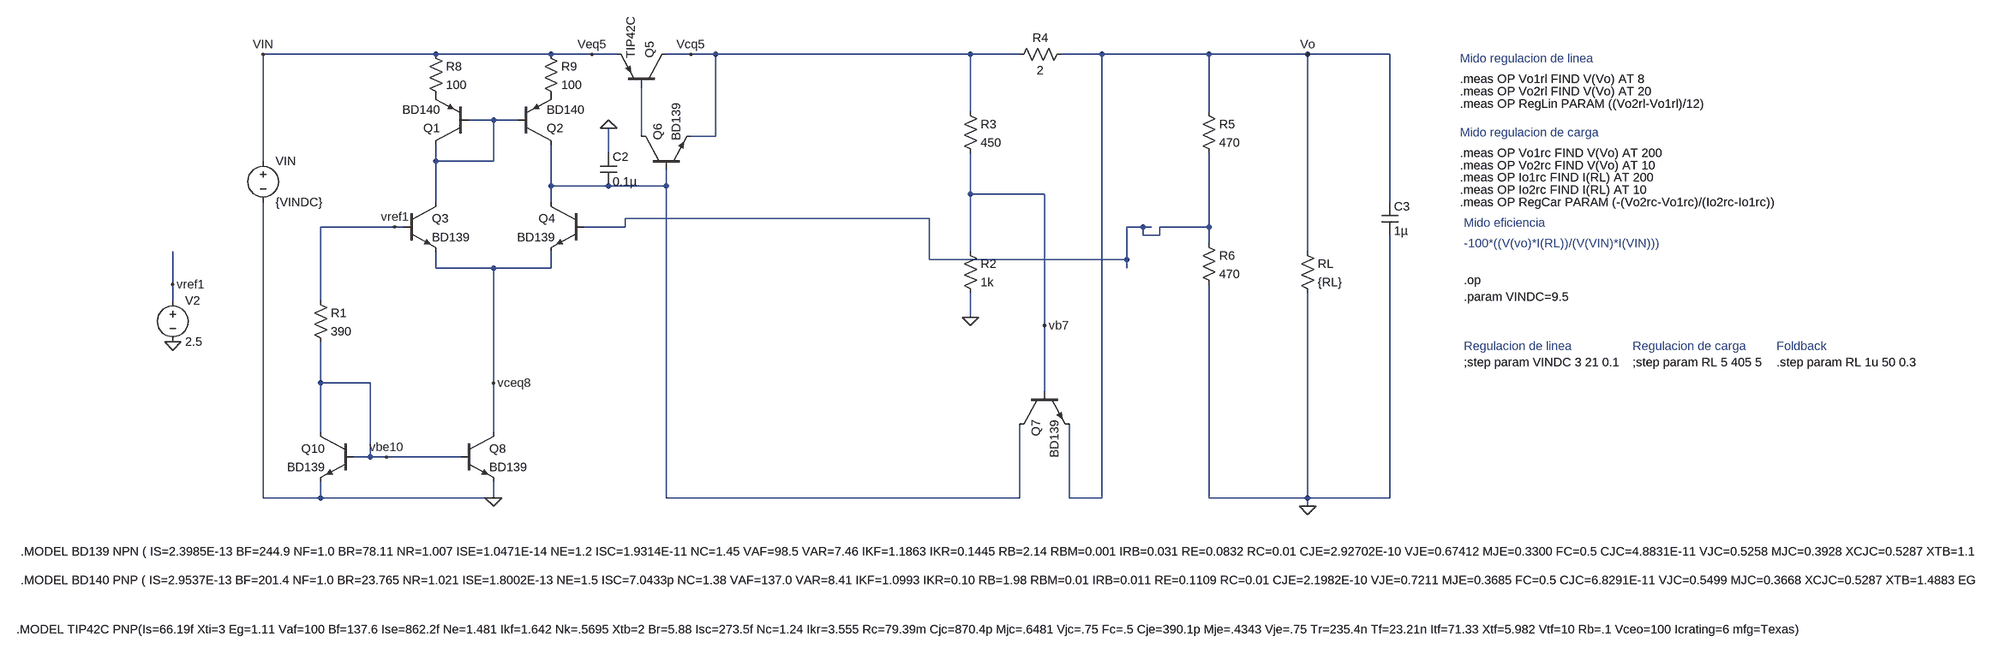
[diagram p0: schematic regulador_lineal_compensado.asc]
regulador_lineal_compensado.asc, the LTspice schematic file:
Version 4.1
SHEET 1 4052 1104
WIRE 96 -32 -240 -32
WIRE 320 -32 96 -32
WIRE 400 -32 320 -32
WIRE 448 -32 400 -32
WIRE 592 -32 544 -32
WIRE 640 -32 592 -32
WIRE 1136 -32 640 -32
WIRE 1232 -32 1136 -32
WIRE 1392 -32 1312 -32
WIRE 1600 -32 1392 -32
WIRE 1792 -32 1600 -32
WIRE 1952 -32 1792 -32
WIRE 1136 80 1136 -32
WIRE 1600 80 1600 -32
WIRE 208 96 160 96
WIRE 256 96 208 96
WIRE 496 128 496 32
WIRE 640 128 640 -32
WIRE 640 128 592 128
WIRE 432 160 432 112
WIRE -240 176 -240 -32
WIRE 96 176 96 144
WIRE 208 176 208 96
WIRE 208 176 96 176
WIRE 320 224 320 144
WIRE 432 224 320 224
WIRE 544 224 544 192
WIRE 544 224 432 224
WIRE 1136 240 1136 160
WIRE 1280 240 1136 240
WIRE 96 256 96 176
WIRE 320 256 320 224
WIRE 1952 256 1952 -32
WIRE 1056 288 464 288
WIRE 16 304 -128 304
WIRE 32 304 16 304
WIRE 464 304 464 288
WIRE 464 304 384 304
WIRE 1472 304 1440 304
WIRE 1488 304 1472 304
WIRE 1600 304 1600 160
WIRE 1600 304 1504 304
WIRE 1472 320 1472 304
WIRE 1504 320 1504 304
WIRE 1504 320 1472 320
WIRE 1600 336 1600 304
WIRE 1136 352 1136 240
WIRE 1792 352 1792 -32
WIRE 1056 368 1056 288
WIRE 1440 368 1440 304
WIRE 1440 368 1056 368
WIRE 96 384 96 352
WIRE 208 384 96 384
WIRE 320 384 320 352
WIRE 320 384 208 384
WIRE 1440 384 1440 368
WIRE -416 416 -416 352
WIRE -416 448 -416 416
WIRE -128 448 -128 304
WIRE 1136 480 1136 432
WIRE 1280 496 1280 240
WIRE -128 608 -128 528
WIRE -32 608 -128 608
WIRE 208 608 208 384
WIRE 1280 624 1280 496
WIRE -128 704 -128 608
WIRE 208 704 208 608
WIRE -32 752 -32 608
WIRE -32 752 -64 752
WIRE 0 752 -32 752
WIRE 144 752 0 752
WIRE -240 832 -240 256
WIRE -128 832 -128 800
WIRE -128 832 -240 832
WIRE 208 832 208 800
WIRE 208 832 -128 832
WIRE 544 832 544 224
WIRE 1232 832 1232 688
WIRE 1232 832 544 832
WIRE 1328 832 1328 688
WIRE 1392 832 1392 -32
WIRE 1392 832 1328 832
WIRE 1600 832 1600 416
WIRE 1792 832 1792 432
WIRE 1792 832 1600 832
WIRE 1952 832 1952 320
WIRE 1952 832 1792 832
WIRE 1792 848 1792 832
FLAG 1792 -32 Vo
FLAG -240 -32 VIN
FLAG 1792 848 0
FLAG 208 832 0
FLAG 1136 480 0
FLAG 0 752 vbe10
FLAG -416 416 vref1
FLAG -416 528 0
FLAG 16 304 vref1
FLAG 208 608 vceq8
FLAG 400 -32 Veq5
FLAG 592 -32 Vcq5
FLAG 1280 496 vb7
FLAG 432 112 0
SYMBOL pnp 160 144 R180
SYMATTR InstName Q1
SYMATTR Value BD140
SYMBOL pnp 256 144 M180
SYMATTR InstName Q2
SYMATTR Value BD140
SYMBOL npn 32 256 R0
SYMATTR InstName Q3
SYMATTR Value BD139
SYMBOL npn 384 256 M0
SYMATTR InstName Q4
SYMATTR Value BD139
SYMBOL pnp 544 32 M270
SYMATTR InstName Q5
SYMATTR Value TIP42C
SYMBOL npn 496 192 R270
SYMATTR InstName Q6
SYMATTR Value BD139
SYMBOL voltage -240 160 R0
WINDOW 123 24 124 Left 2
WINDOW 39 0 0 Left 0
SYMATTR InstName VIN
SYMATTR Value {VINDC}
SYMBOL res 80 -48 R0
SYMATTR InstName R8
SYMATTR Value 100
SYMBOL res 304 -48 R0
SYMATTR InstName R9
SYMATTR Value 100
SYMBOL cap 1936 256 R0
SYMATTR InstName C3
SYMATTR Value 1µ
SYMBOL res 1120 64 R0
SYMATTR InstName R3
SYMATTR Value 450
SYMBOL res 1120 336 R0
SYMATTR InstName R2
SYMATTR Value 1k
SYMBOL res 1328 -48 R90
WINDOW 0 0 56 VBottom 2
WINDOW 3 32 56 VTop 2
SYMATTR InstName R4
SYMATTR Value 2
SYMBOL npn 1232 624 M90
SYMATTR InstName Q7
SYMATTR Value BD139
SYMBOL res 1584 64 R0
SYMATTR InstName R5
SYMATTR Value 470
SYMBOL res 1584 320 R0
SYMATTR InstName R6
SYMATTR Value 470
SYMBOL npn 144 704 R0
SYMATTR InstName Q8
SYMATTR Value BD139
SYMBOL npn -64 704 M0
SYMATTR InstName Q10
SYMATTR Value BD139
SYMBOL res 1776 336 R0
SYMATTR InstName RL
SYMATTR Value {RL}
SYMBOL res -144 432 R0
SYMATTR InstName R1
SYMATTR Value 390
SYMBOL voltage -416 432 R0
WINDOW 123 24 124 Left 2
WINDOW 39 0 0 Left 0
SYMATTR InstName V2
SYMATTR Value 2.5
SYMBOL cap 416 160 R0
SYMATTR InstName C2
SYMATTR Value 0.1µ
TEXT 2088 -24 Left 2 ;Mido regulacion de linea
TEXT 2088 16 Left 2 !.meas OP Vo1rl FIND V(Vo) AT 8
TEXT 2088 40 Left 2 !.meas OP Vo2rl FIND V(Vo) AT 20
TEXT 2088 64 Left 2 !.meas OP RegLin PARAM ((Vo2rl-Vo1rl)/12)
TEXT 2088 120 Left 2 ;Mido regulacion de carga
TEXT 2088 160 Left 2 !.meas OP Vo1rc FIND V(Vo) AT 200
TEXT 2088 184 Left 2 !.meas OP Vo2rc FIND V(Vo) AT 10
TEXT 2088 208 Left 2 !.meas OP Io1rc FIND I(RL) AT 200
TEXT 2088 232 Left 2 !.meas OP Io2rc FIND I(RL) AT 10
TEXT 2096 296 Left 2 ;Mido eficiencia
TEXT 2096 336 Left 2 ;-100*((V(vo)*I(RL))/(V(VIN)*I(VIN)))
TEXT 2096 440 Left 2 !.param VINDC=9.5
TEXT 2088 256 Left 2 !.meas OP RegCar PARAM (-(Vo2rc-Vo1rc)/(Io2rc-Io1rc))
TEXT 2096 568 Left 2 !;step param VINDC 3 21 0.1
TEXT -712 936 Left 2 !.MODEL BD139 NPN ( IS=2.3985E-13 BF=244.9 NF=1.0 BR=78.11 NR=1.007 ISE=1.0471E-14 NE=1.2 ISC=1.9314E-11 NC=1.45 VAF=98.5 VAR=7.46 IKF=1.1863 IKR=0.1445 RB=2.14 RBM=0.001 IRB=0.031 RE=0.0832 RC=0.01 CJE=2.92702E-10 VJE=0.67412 MJE=0.3300 FC=0.5 CJC=4.8831E-11 VJC=0.5258 MJC=0.3928 XCJC=0.5287 XTB=1.1398 EG=1.2105 XTI=3.0 Vceo=80 Icrating=3 mfg=fairchild)
TEXT -712 992 Left 2 !.MODEL BD140 PNP ( IS=2.9537E-13 BF=201.4 NF=1.0 BR=23.765 NR=1.021 ISE=1.8002E-13 NE=1.5 ISC=7.0433p NC=1.38 VAF=137.0 VAR=8.41 IKF=1.0993 IKR=0.10 RB=1.98 RBM=0.01 IRB=0.011 RE=0.1109 RC=0.01 CJE=2.1982E-10 VJE=0.7211 MJE=0.3685 FC=0.5 CJC=6.8291E-11 VJC=0.5499 MJC=0.3668 XCJC=0.5287 XTB=1.4883 EG=1.2343 XTI=3.0 Vceo=80 Icrating=3 mfg=fairchild)
TEXT 2704 568 Left 2 !.step param RL 1u 50 0.3
TEXT 2704 536 Left 2 ;Foldback
TEXT 2096 536 Left 2 ;Regulacion de linea
TEXT 2424 568 Left 2 !;step param RL 5 405 5
TEXT 2424 536 Left 2 ;Regulacion de carga
TEXT -720 1088 Left 2 !.MODEL TIP42C PNP(Is=66.19f Xti=3 Eg=1.11 Vaf=100 Bf=137.6 Ise=862.2f Ne=1.481 Ikf=1.642 Nk=.5695 Xtb=2 Br=5.88 Isc=273.5f Nc=1.24 Ikr=3.555 Rc=79.39m Cjc=870.4p Mjc=.6481 Vjc=.75 Fc=.5 Cje=390.1p Mje=.4343 Vje=.75 Tr=235.4n Tf=23.21n Itf=71.33 Xtf=5.982 Vtf=10 Rb=.1 Vceo=100 Icrating=6 mfg=Texas)
TEXT 2096 408 Left 2 !.op

The netlist it stands for:
* regulador_lineal_compensado.asc
Q1 N001 N001 P001 0 BD140
Q2 N003 N001 P002 0 BD140
Q3 N001 vref1 vceq8 0 BD139
Q4 N003 N004 vceq8 0 BD139
Q5 Vcq5 N002 Veq5 0 TIP42C
Q6 N002 N003 Vcq5 0 BD139
VIN Veq5 0 {VINDC}
R8 Veq5 P001 100
R9 Veq5 P002 100
C3 Vo 0 1µ
R3 Vcq5 vb7 450
R2 vb7 0 1k
R4 Vo Vcq5 2
Q7 N003 vb7 Vo 0 BD139
R5 Vo N004 470
R6 N004 0 470
Q8 vceq8 vbe10 0 0 BD139
Q10 vbe10 vbe10 0 0 BD139
RL Vo 0 {RL}
R1 vref1 vbe10 390
V2 vref1 0 2.5
C2 0 N003 0.1µ
.model NPN NPN
.model PNP PNP
.lib standard.bjt
* Mido regulacion de linea
.meas OP Vo1rl FIND V(Vo) AT 8
.meas OP Vo2rl FIND V(Vo) AT 20
.meas OP RegLin PARAM ((Vo2rl-Vo1rl)/12)
* Mido regulacion de carga
.meas OP Vo1rc FIND V(Vo) AT 200
.meas OP Vo2rc FIND V(Vo) AT 10
.meas OP Io1rc FIND I(RL) AT 200
.meas OP Io2rc FIND I(RL) AT 10
* Mido eficiencia
* -100*((V(vo)*I(RL))/(V(VIN)*I(VIN)))
.param VINDC=9.5
.meas OP RegCar PARAM (-(Vo2rc-Vo1rc)/(Io2rc-Io1rc))
;step param VINDC 3 21 0.1
.MODEL BD139 NPN ( IS=2.3985E-13 BF=244.9 NF=1.0 BR=78.11 NR=1.007 ISE=1.0471E-14 NE=1.2 ISC=1.9314E-11 NC=1.45 VAF=98.5 VAR=7.46 IKF=1.1863 IKR=0.1445 RB=2.14 RBM=0.001 IRB=0.031 RE=0.0832 RC=0.01 CJE=2.92702E-10 VJE=0.67412 MJE=0.3300 FC=0.5 CJC=4.8831E-11 VJC=0.5258 MJC=0.3928 XCJC=0.5287 XTB=1.1398 EG=1.2105 XTI=3.0 Vceo=80 Icrating=3 mfg=fairchild)
.MODEL BD140 PNP ( IS=2.9537E-13 BF=201.4 NF=1.0 BR=23.765 NR=1.021 ISE=1.8002E-13 NE=1.5 ISC=7.0433p NC=1.38 VAF=137.0 VAR=8.41 IKF=1.0993 IKR=0.10 RB=1.98 RBM=0.01 IRB=0.011 RE=0.1109 RC=0.01 CJE=2.1982E-10 VJE=0.7211 MJE=0.3685 FC=0.5 CJC=6.8291E-11 VJC=0.5499 MJC=0.3668 XCJC=0.5287 XTB=1.4883 EG=1.2343 XTI=3.0 Vceo=80 Icrating=3 mfg=fairchild)
.step param RL 1u 50 0.3
* Foldback
* Regulacion de linea
;step param RL 5 405 5
* Regulacion de carga
.MODEL TIP42C PNP(Is=66.19f Xti=3 Eg=1.11 Vaf=100 Bf=137.6 Ise=862.2f Ne=1.481 Ikf=1.642 Nk=.5695 Xtb=2 Br=5.88 Isc=273.5f Nc=1.24 Ikr=3.555 Rc=79.39m Cjc=870.4p Mjc=.6481 Vjc=.75 Fc=.5 Cje=390.1p Mje=.4343 Vje=.75 Tr=235.4n Tf=23.21n Itf=71.33 Xtf=5.982 Vtf=10 Rb=.1 Vceo=100 Icrating=6 mfg=Texas)
.op
.backanno
.end

* Results of the author's LTspice run, read from the files saved beside the schematic
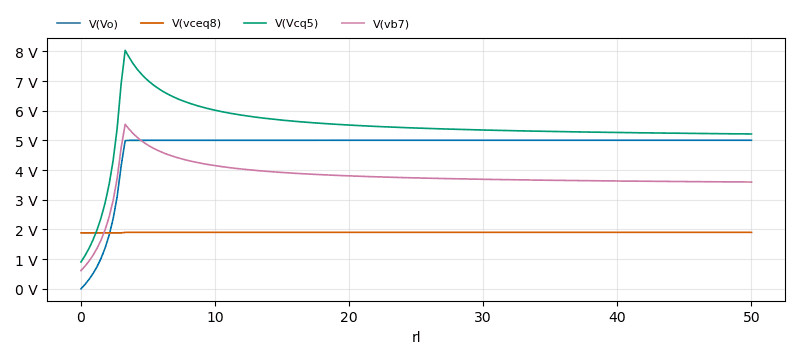
[diagram p1: Operating Point of regulador_lineal_compensado.asc, plotted from the saved traces]
* Operating Point, 1 run:
*   V(Vo): 457 nV at rl=1 µ, 5.007 V at rl=50 , min 457 nV, max 5.007 V
*   V(vceq8): 1.885 V at rl=1 µ, 1.903 V at rl=50 , min 1.885 V, max 1.903 V
*   V(Vcq5): 904.4 mV at rl=1 µ, 5.218 V at rl=50 , min 904.4 mV, max 8.036 V
*   V(vb7): 615.8 mV at rl=1 µ, 3.599 V at rl=50 , min 615.8 mV, max 5.541 V
* From the log:
*   vo1rl: V(Vo)=5.00545551279 at 8
*   vo2rl: V(Vo)=5.00653781889 at 20
*   reglin: ((Vo2rl-Vo1rl)/12)=9.01921748477e-05
*   Measurement "vo1rc" FAIL'ed
*   vo2rc: V(Vo)=5.00583734501 at 10
*   Measurement "io1rc" FAIL'ed
*   io2rc: I(RL)=0.500690786113 at 10
*   Measurement "regcar" FAIL'ed